# Altium schematic sheet GPSDO.SchDoc
size 594 x 420 mm; SheetNumber: 1; SheetTotal: 1
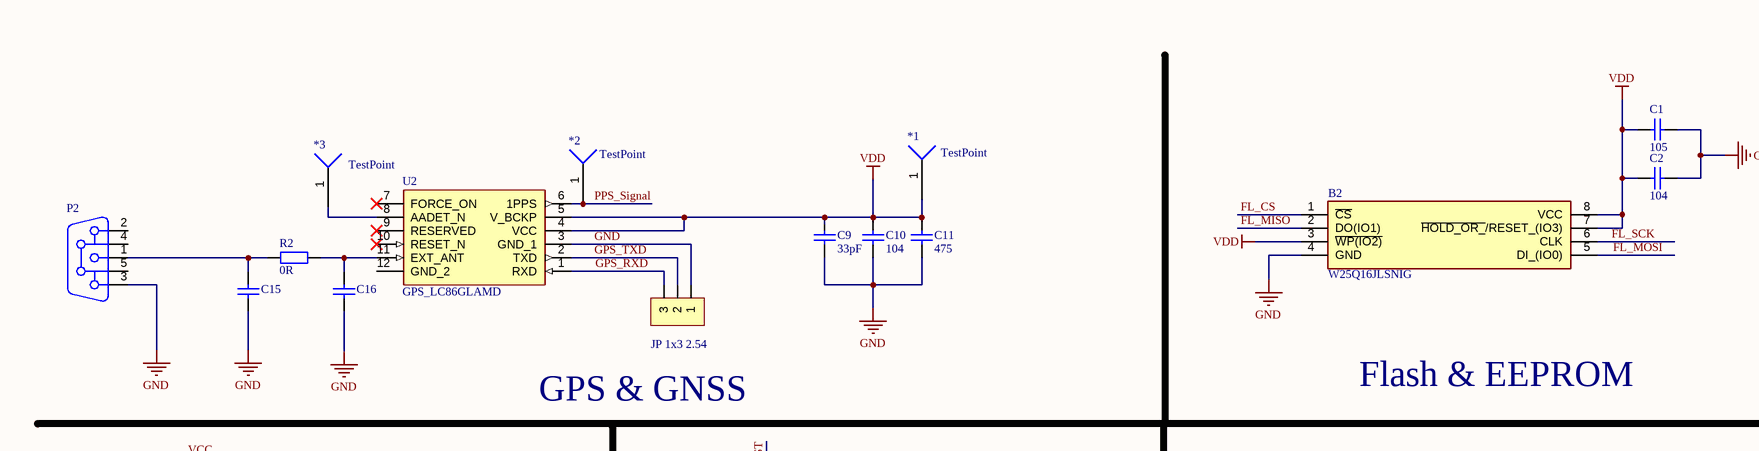
[diagram p0: GPSDO.SchDoc, top left]
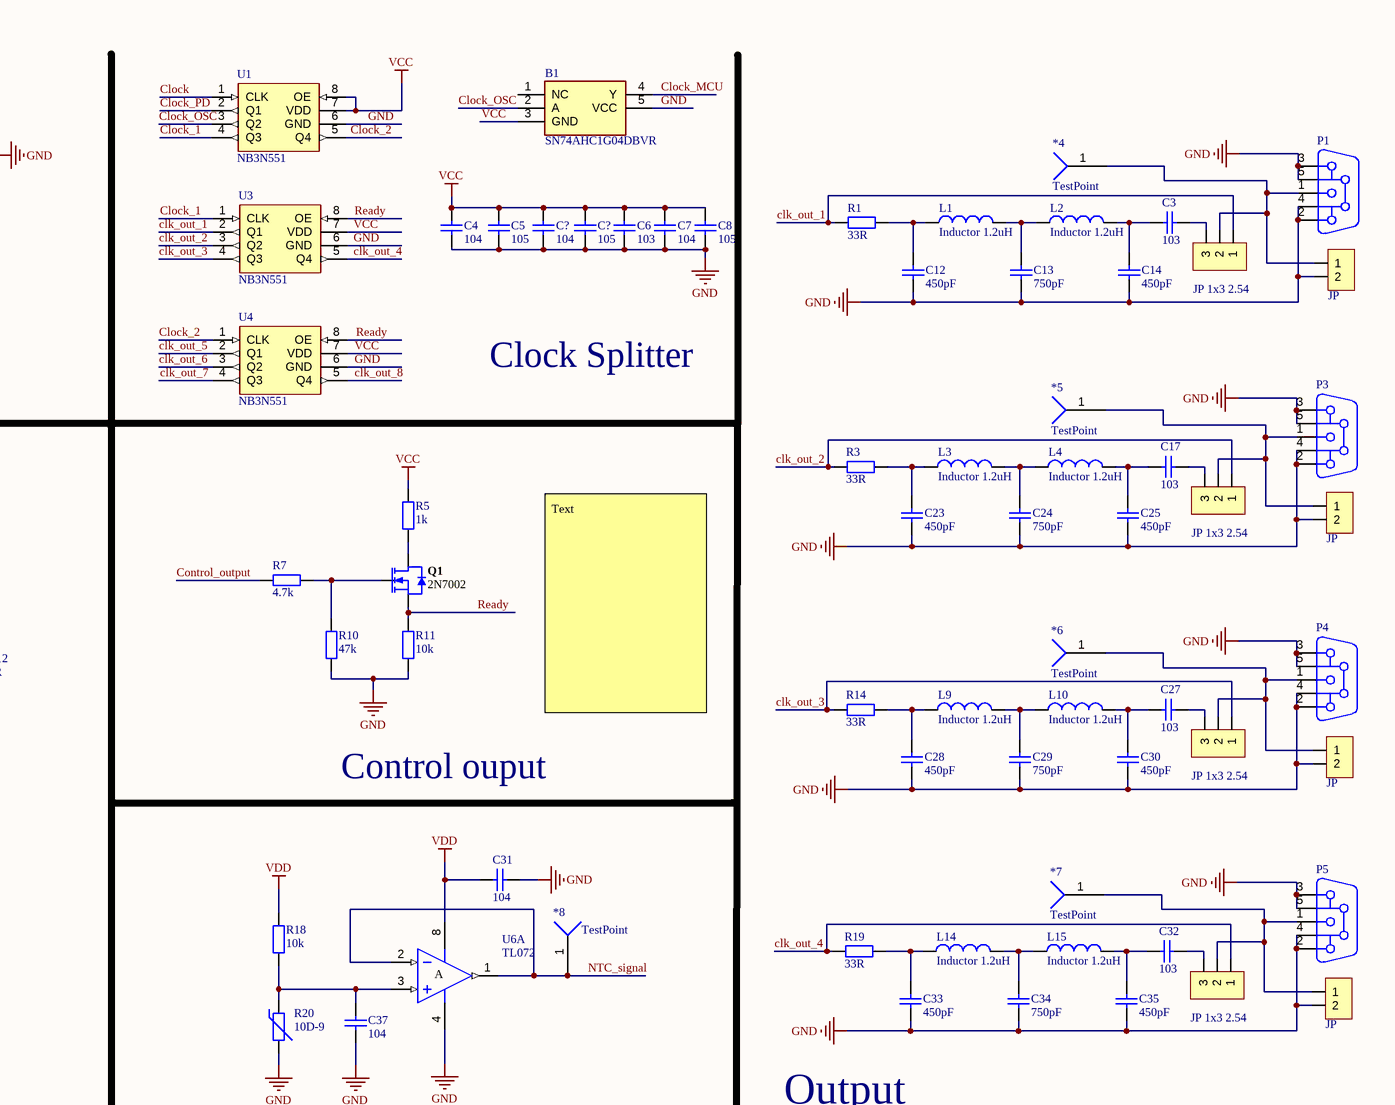
[diagram p1: GPSDO.SchDoc, top right]
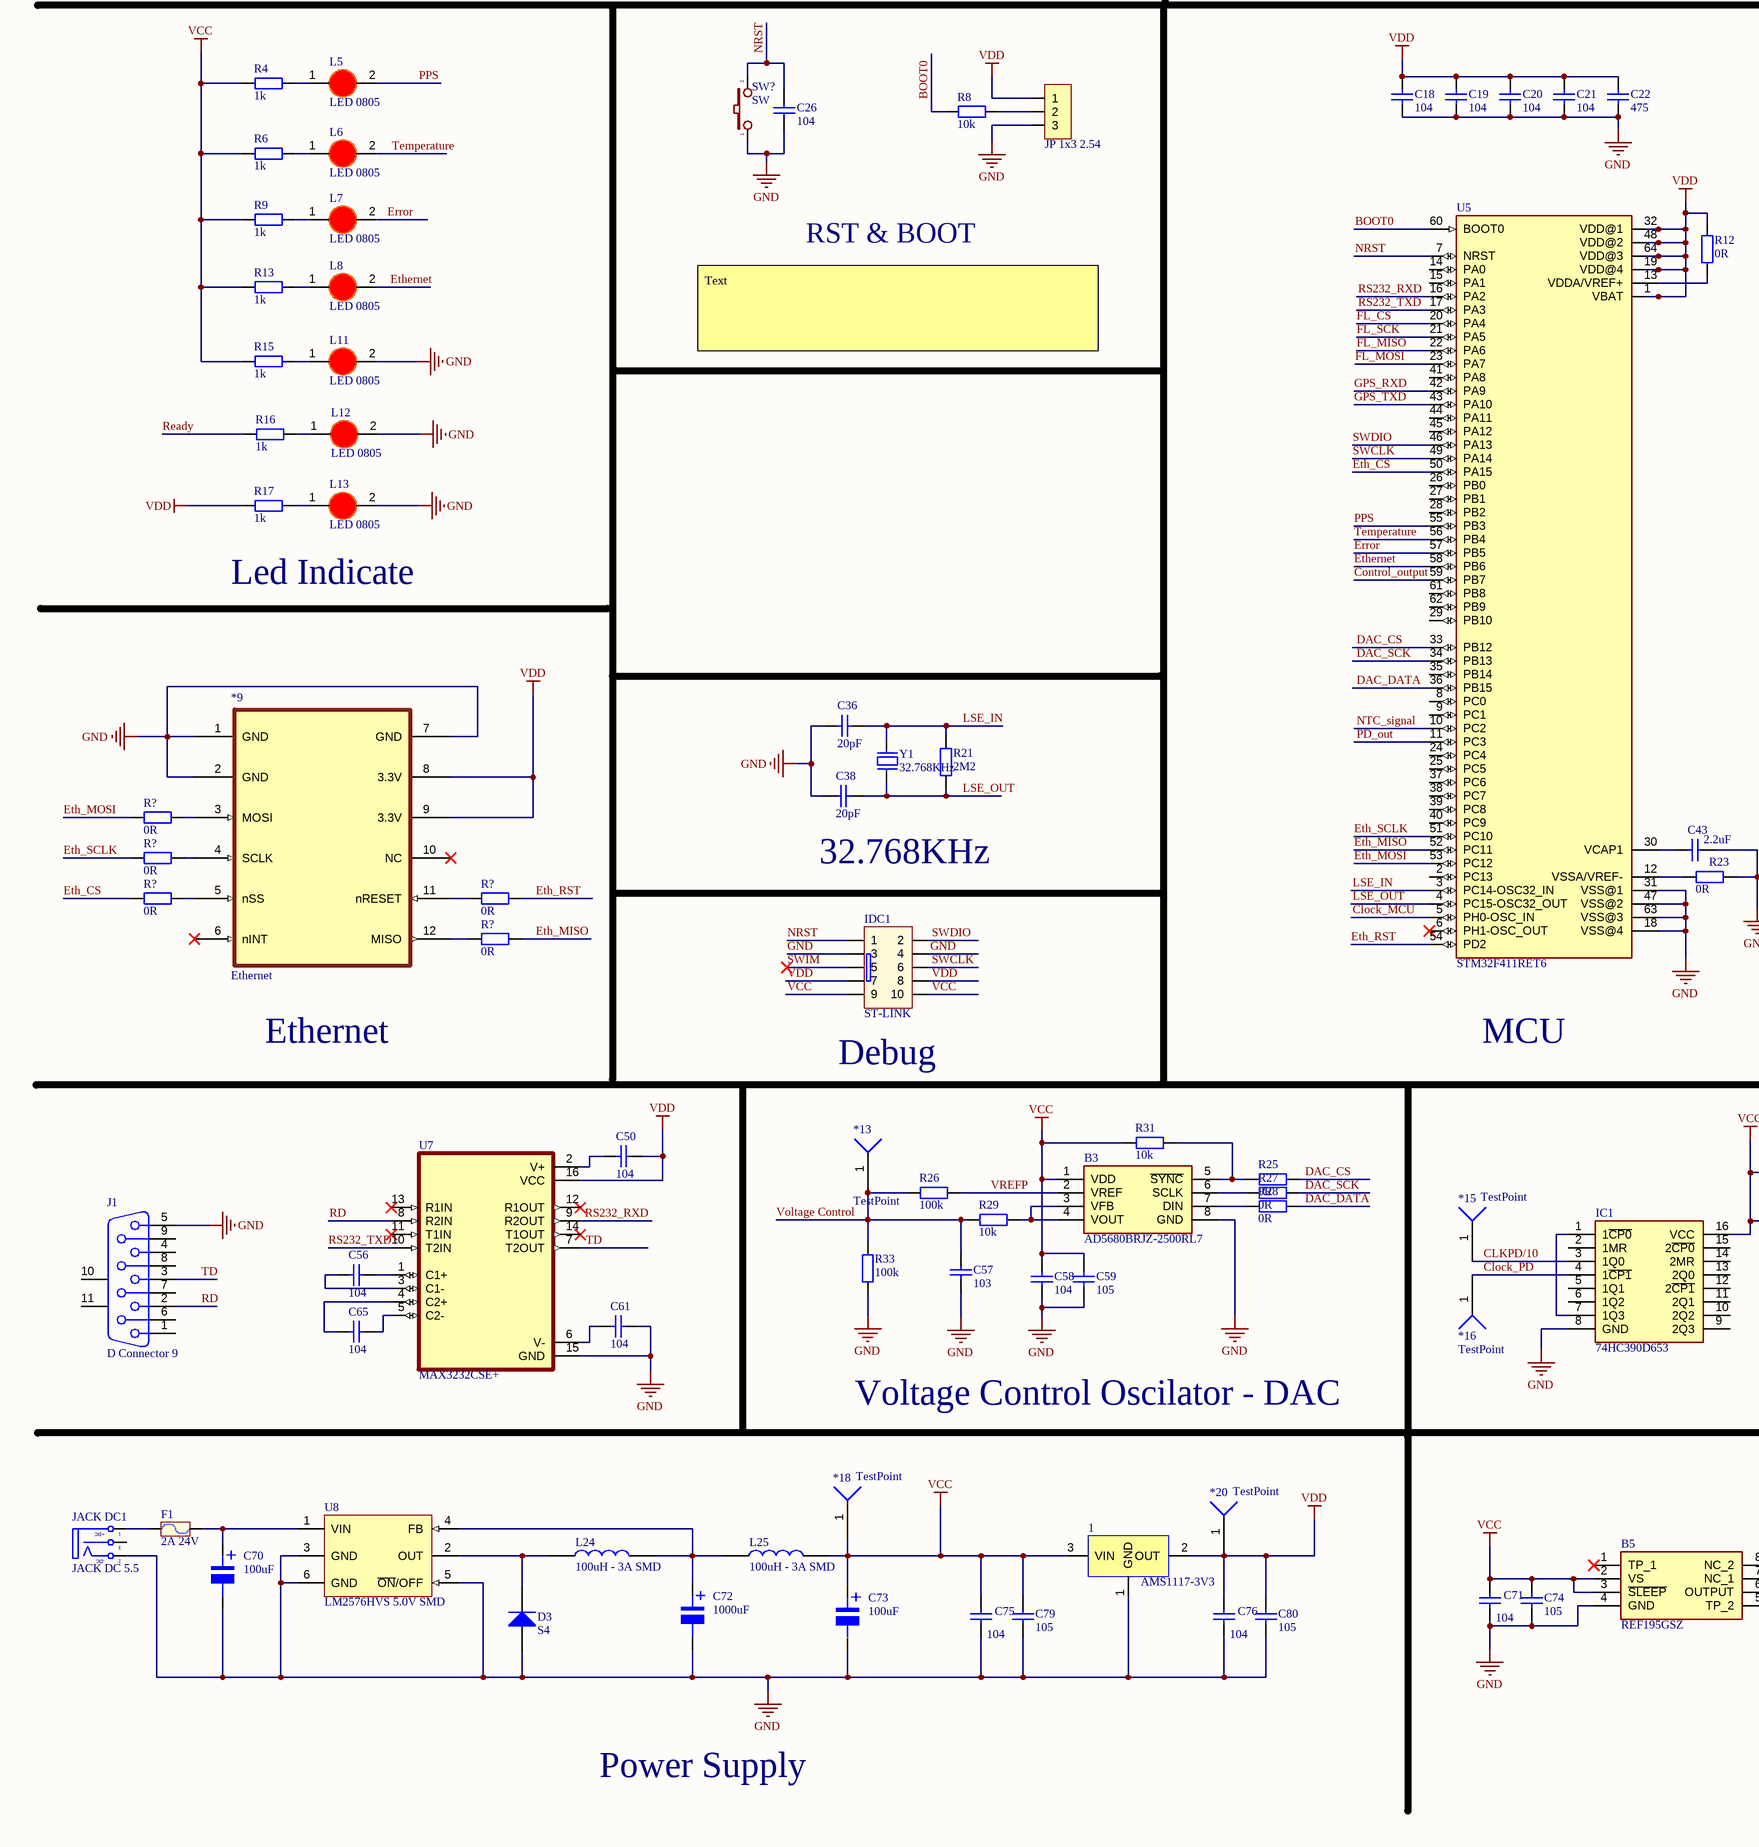
[diagram p2: GPSDO.SchDoc, bottom left]
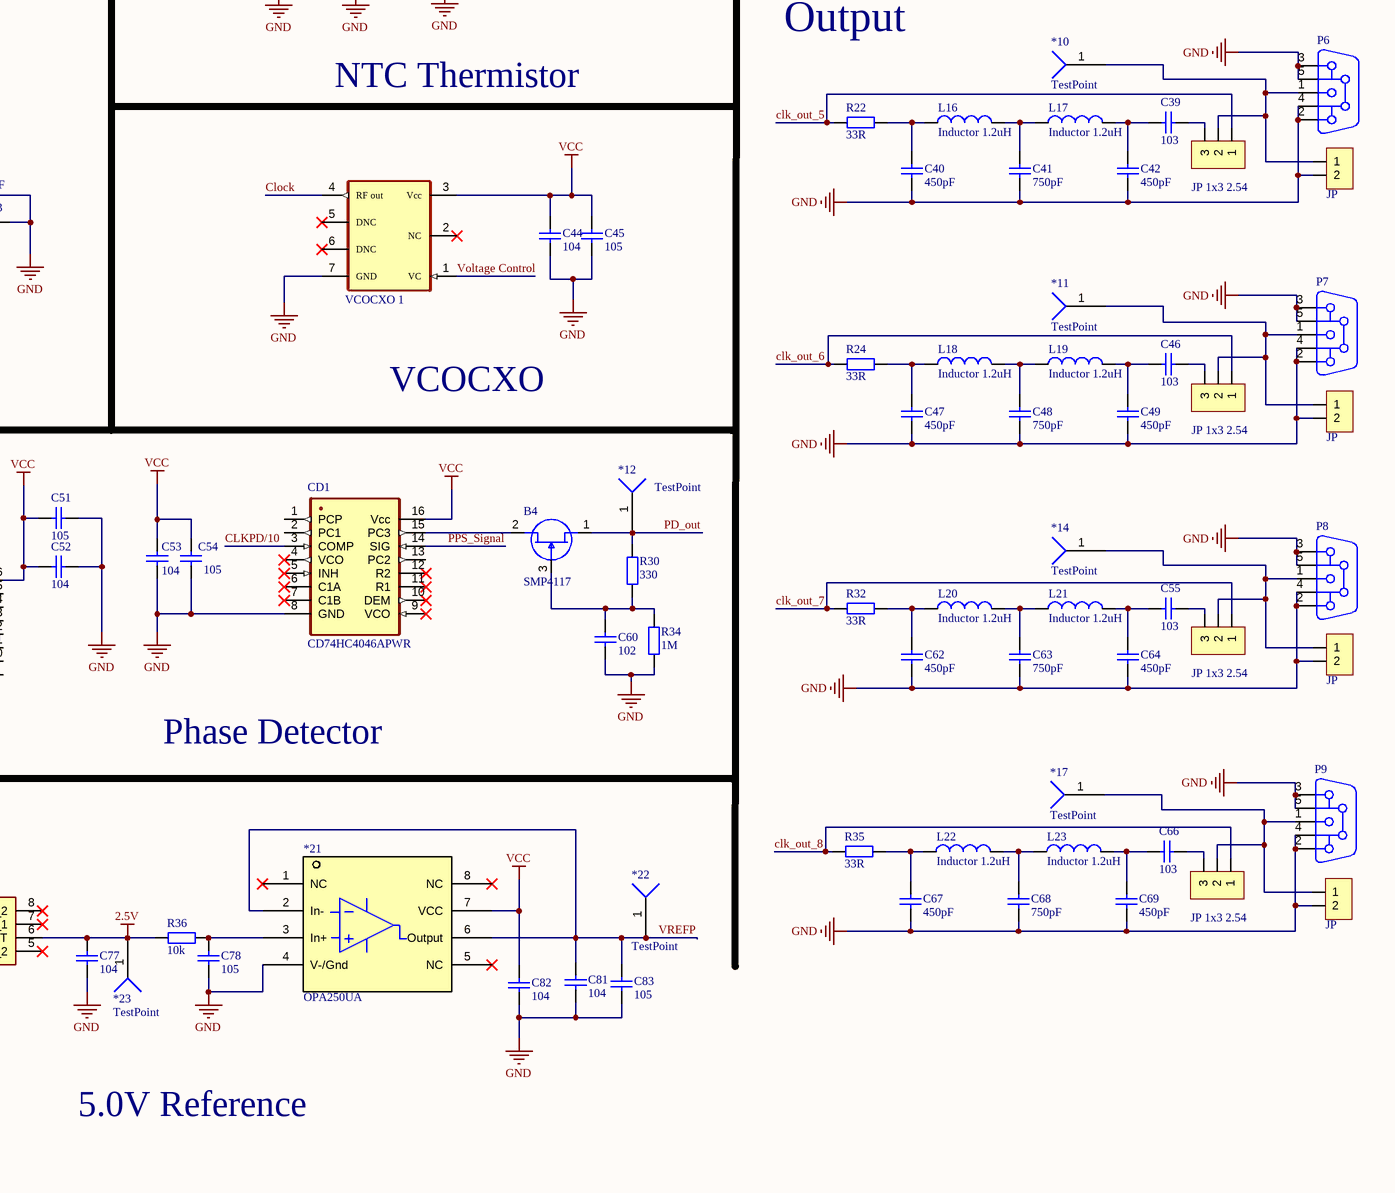
[diagram p3: GPSDO.SchDoc, bottom right]

## Parts
(Parts that share a designator on the sheet are numbered #1, #2 ... from top to bottom, then left to right.)
1  AMS1117-3V3  [SOT223]
*1  TestPoint  [TestPoint]
*2  TestPoint  [TestPoint]
*3  TestPoint  [TestPoint]
*4  TestPoint  [TestPoint]
*5  TestPoint  [TestPoint]
*6  TestPoint  [TestPoint]
*7  TestPoint  [TestPoint]
*8  TestPoint  [TestPoint]
*9  Ethernet  [PCBComponent_1]
*10  TestPoint  [TestPoint]
*11  TestPoint  [TestPoint]
*12  TestPoint  [TestPoint]
*13  TestPoint  [TestPoint]
*14  TestPoint  [TestPoint]
*15  TestPoint  [TestPoint]
*16  TestPoint  [TestPoint]
*17  TestPoint  [TestPoint]
*18  TestPoint  [TestPoint]
*20  TestPoint  [TestPoint]
*21  OPA250UA  [OPA350UA]
*22  TestPoint  [TestPoint]
*23  TestPoint  [TestPoint]
B1  SN74AHC1G04DBVR  [SOT95P280X145-5N]
B2  W25Q16JLSNIG  [SOIC127P600X175-8N]
B3  AD5680BRJZ-2500RL7  [SOT65P280X145-8N]
B4  SMP4117  [SOT95P237X112-3N]
B5  REF195GSZ  [SOIC127P600X175-8N]
C1  105  [tu 0805]
C2  104  [tu 0805]
C3  103  [tu 0805]
C4  104  [tu 0805]
C5  105  [tu 0805]
C6  103  [tu 0805]
C7  104  [tu 0805]
C8  105  [tu 0805]
C9  33pF  [tu 0805]
C10  104  [tu 0805]
C11  475  [tu 0805]
C12  450pF  [tu 0805]
C13  750pF  [tu 0805]
C14  450pF  [tu 0805]
C15  (no value)  [tu 0805]
C16  (no value)  [tu 0805]
C17  103  [tu 0805]
C18  104  [tu 0805]
C19  104  [tu 0805]
C20  104  [tu 0805]
C21  104  [tu 0805]
C22  475  [tu 0805]
C23  450pF  [tu 0805]
C24  750pF  [tu 0805]
C25  450pF  [tu 0805]
C26  104  [tu 0805]
C27  103  [tu 0805]
C28  450pF  [tu 0805]
C29  750pF  [tu 0805]
C30  450pF  [tu 0805]
C31  104  [tu 0805]
C32  103  [tu 0805]
C33  450pF  [tu 0805]
C34  750pF  [tu 0805]
C35  450pF  [tu 0805]
C36  20pF  [tu 0805]
C37  104  [tu 0805]
C38  20pF  [tu 0805]
C39  103  [tu 0805]
C40  450pF  [tu 0805]
C41  750pF  [tu 0805]
C42  450pF  [tu 0805]
C43  2.2uF  [tu 0805]
C44  104  [tu 0805]
C45  105  [tu 0805]
C46  103  [tu 0805]
C47  450pF  [tu 0805]
C48  750pF  [tu 0805]
C49  450pF  [tu 0805]
C50  104  [tu 0805]
C51  105  [tu 0805]
C52  104  [tu 0805]
C53  104  [tu 0805]
C54  105  [tu 0805]
C55  103  [tu 0805]
C56  104  [tu 0805]
C57  103  [tu 0805]
C58  104  [tu 0805]
C59  105  [tu 0805]
C60  102  [tu 0805]
C61  104  [tu 0805]
C62  450pF  [tu 0805]
C63  750pF  [tu 0805]
C64  450pF  [tu 0805]
C65  104  [tu 0805]
C66  103  [tu 0805]
C67  450pF  [tu 0805]
C68  750pF  [tu 0805]
C69  450pF  [tu 0805]
C70  100uF  [tu nhom 6.3 (d)]
C71  104  [tu 0805]
C72  1000uF  [tu nhom 10 (G)]
C73  100uF  [tu nhom 6.3 (d)]
C74  105  [tu 0805]
C75  104  [tu 0805]
C76  104  [tu 0805]
C77  104  [tu 0805]
C78  105  [tu 0805]
C79  105  [tu 0805]
C80  105  [tu 0805]
C81  104  [tu 0805]
C82  104  [tu 0805]
C83  105  [tu 0805]
C?#1  104  [tu 0805]
C?#2  105  [tu 0805]
CD1  CD74HC4046APWR  [TSSOP16]
D3  S4  [DIODE SOD-123]
F1  2A 24V  [Cau chi tu phuc hoi 2A 24V SMD1812]
IC1  74HC390D653  [74HC390D653]
IDC1  ST-LINK  [IDC10]
J1  D Connector 9  [DSUB1.385-2H9]
JACK_DC1  JACK DC 5.5  [JACK DC 5.5]
JP1  JP  [JP 1x2 DT]
JP2  JP 1x3 2.54  [JP 1x3 CT]
JP3  JP 1x3 2.54  [JP 1x3 DT]
JP4  JP  [JP 1x2 DT]
JP5  JP 1x3 2.54  [JP 1x3 CT]
JP6  JP 1x3 2.54  [JP 1x3 DT]
JP7  JP  [JP 1x2 DT]
JP8  JP 1x3 2.54  [JP 1x3 CT]
JP9  JP  [JP 1x2 DT]
JP10  JP 1x3 2.54  [JP 1x3 CT]
JP11  JP  [JP 1x2 DT]
JP12  JP 1x3 2.54  [JP 1x3 CT]
JP13  JP  [JP 1x2 DT]
JP14  JP 1x3 2.54  [JP 1x3 CT]
JP15  JP  [JP 1x2 DT]
JP16  JP 1x3 2.54  [JP 1x3 CT]
JP17  JP  [JP 1x2 DT]
JP18  JP 1x3 2.54  [JP 1x3 CT]
L1  Inductor 1.2uH  [INDC2012X100N]
L2  Inductor 1.2uH  [INDC2012X100N]
L3  Inductor 1.2uH  [INDC2012X100N]
L4  Inductor 1.2uH  [INDC2012X100N]
L5  LED 0805  [LED-0805-Red]
L6  LED 0805  [LED-0805-Red]
L7  LED 0805  [LED-0805-Red]
L8  LED 0805  [LED-0805-Red]
L9  Inductor 1.2uH  [INDC2012X100N]
L10  Inductor 1.2uH  [INDC2012X100N]
L11  LED 0805  [LED-0805-Red]
L12  LED 0805  [LED-0805-Red]
L13  LED 0805  [LED-0805-Red]
L14  Inductor 1.2uH  [INDC2012X100N]
L15  Inductor 1.2uH  [INDC2012X100N]
L16  Inductor 1.2uH  [INDC2012X100N]
L17  Inductor 1.2uH  [INDC2012X100N]
L18  Inductor 1.2uH  [INDC2012X100N]
L19  Inductor 1.2uH  [INDC2012X100N]
L20  Inductor 1.2uH  [INDC2012X100N]
L21  Inductor 1.2uH  [INDC2012X100N]
L22  Inductor 1.2uH  [INDC2012X100N]
L23  Inductor 1.2uH  [INDC2012X100N]
L24  100uH - 3A SMD  [Cuon Cam 12x12x10]
L25  100uH - 3A SMD  [Cuon Cam 12x12x10]
P1  (no value)  [SMA-V]
P2  (no value)  [SMA-V]
P3  (no value)  [SMA-V]
P4  (no value)  [SMA-V]
P5  (no value)  [SMA-V]
P6  (no value)  [SMA-V]
P7  (no value)  [SMA-V]
P8  (no value)  [SMA-V]
P9  (no value)  [SMA-V]
Q1  2N7002  [SOT23-123]
R1  33R  [tro smd 0805]
R2  0R  [tro smd 0805]
R3  33R  [tro smd 0805]
R4  1k  [tro smd 0805]
R5  1k  [tro smd 0805]
R6  1k  [tro smd 0805]
R7  4.7k  [tro smd 0805]
R8  10k  [tro smd 0805]
R9  1k  [tro smd 0805]
R10  47k  [tro smd 0805]
R11  10k  [tro smd 0805]
R12  0R  [tro smd 0805]
R13  1k  [tro smd 0805]
R14  33R  [tro smd 0805]
R15  1k  [tro smd 0805]
R16  1k  [tro smd 0805]
R17  1k  [tro smd 0805]
R18  10k  [tro smd 0805]
R19  33R  [tro smd 0805]
R20  10D-9  [tro nhiet d-9]
R21  2M2  [tro smd 0805]
R22  33R  [tro smd 0805]
R23  0R  [tro smd 0805]
R24  33R  [tro smd 0805]
R25  0R  [tro smd 0805]
R26  100k  [tro smd 0805]
R27  0R  [tro smd 0805]
R28  0R  [tro smd 0805]
R29  10k  [tro smd 0805]
R30  330  [tro smd 0805]
R31  10k  [tro smd 0805]
R32  33R  [tro smd 0805]
R33  100k  [tro smd 0805]
R34  1M  [tro smd 0805]
R35  33R  [tro smd 0805]
R36  10k  [tro smd 0805]
R?#1  0R  [tro smd 0805]
R?#2  0R  [tro smd 0805]
R?#3  0R  [tro smd 0805]
R?#4  0R  [tro smd 0805]
R?#5  0R  [tro smd 0805]
SW?  SW  [SW1-DIP]
U1  NB3N551  [SOIC8]
U2  GPS_LC86GLAMD  [LC86LICMD]
U3  NB3N551  [SOIC8]
U4  NB3N551  [SOIC8]
U5  STM32F411RET6  [QFP50P1200X1200X160-64N]
U6  TL072  [SO8]  (part A of 2)
U7  MAX3232CSE+  [SOIC127P600X175-16N]
U8  LM2576HVS 5.0V SMD  [TO263-5]
VCOCXO_1  OCXO  [PCBComponent_1]  (value not drawn)
Y1  32.768KHz  [Thach Anh 2 chan cam]

## Nets
2.5V: *23.1 B5.6(OUTPUT) C77.1 R36.1
GND: 1.1(GND) *9.1(GND) *9.2(GND) *9.7(GND) *21.4(V-/Gnd) B1.5(VCC) B2.4(GND) B3.8(GND) B5.4(GND) C1.2 C2.2 C4.2 C5.2 C6.1 C7.2 C8.2 C9.2 C10.2 C11.2 C12.2 C13.2 C14.2 C15.2 C16.2 C18.2 C19.2 C20.2 C21.2 C22.2 C23.2 C24.2 C25.2 C26.2 C28.2 C29.2 C30.2 C31.2 C33.2 C34.2 C35.2 C36.1 C37.2 C38.1 C40.2 C41.2 C42.2 C43.2 C44.2 C45.2 C47.2 C48.2 C49.2 C51.2 C52.2 C53.2 C54.2 C57.2 C58.2 C59.2 C60.2 C61.2 C62.2 C63.2 C64.2 C67.2 C68.2 C69.2 C70.2 C71.2 C72.2 C73.2 C74.2 C75.2 C76.2 C77.2 C78.2 C79.2 C80.2 C81.2 C82.2 C83.2 C?#1.2 C?#2.2 CD1.8(GND) D3.1(A) IC1.8(GND) IDC1.3 IDC1.4 J1.5 JACK_DC1.2(TN) JP1.2 JP3.1 JP4.2 JP6.3 JP7.2 JP9.2 JP11.2 JP13.2 JP15.2 JP17.2 L11.2(K) L12.2(K) L13.2(K) P1.2 P1.3 P1.4 P1.5 P2.3 P3.2 P3.3 P3.4 P3.5 P4.2 P4.3 P4.4 P4.5 P5.2 P5.3 P5.4 P5.5 P6.2 P6.3 P6.4 P6.5 P7.2 P7.3 P7.4 P7.5 P8.2 P8.3 P8.4 P8.5 P9.2 P9.3 P9.4 P9.5 R10.2 R11.2 R20.2 R23.1 R33.2 R34.2 SW?.1 U1.6(GND) U2.3(GND_1) U3.6(GND) U4.6(GND) U5.18(VSS@4) U5.31(VSS@1) U5.47(VSS@2) U5.63(VSS@3) U6.4(V-) U7.15(GND) U8.3(GND) U8.5(~{ON}/OFF) U8.6(GND) VCOCXO_1.7(GND)
VCC: 1.3(VIN) *18.1 *21.7(VCC) B1.3(GND) B3.1(VDD) B5.2(VS) B5.3(~{SLEEP}) C4.1 C5.1 C6.2 C7.1 C8.1 C44.1 C45.1 C51.1 C52.1 C53.1 C54.1 C58.1 C59.1 C71.1 C73.1 C74.1 C75.1 C79.1 C82.1 C?#1.1 C?#2.1 CD1.16(Vcc) IC1.16(VCC) IDC1.9 IDC1.10 L25.2 R4.1 R5.1 R6.1 R9.1 R13.1 R15.1 R31.2 U1.7(VDD) U1.8(OE) U3.7(VDD) U4.7(VDD) VCOCXO_1.3(Vcc)
VDD: 1.2(OUT) *1.1 *9.8(3.3V) *9.9(3.3V) *20.1 B2.3(~{WP(IO2)}) B2.7(~{HOLD_OR_}/RESET_(IO3)) B2.8(VCC) C1.1 C2.1 C9.1 C10.1 C11.1 C18.1 C19.1 C20.1 C21.1 C22.1 C31.1 C50.1 C76.1 C80.1 IDC1.7 IDC1.8 JP6.1 R12.1 R17.1 R18.1 U2.4(VCC) U2.5(V_BCKP) U5.1(VBAT) U5.19(VDD@4) U5.32(VDD@1) U5.48(VDD@2) U5.64(VDD@3) U6.8(V+) U7.16(VCC)
BOOT0: R8.2 U5.60(BOOT0)
clk_out_1: JP2.1 R1.2 U3.2(Q1)
clk_out_2: JP5.1 R3.2 U3.3(Q2)
clk_out_3: JP8.1 R14.2 U3.4(Q3)
clk_out_4: JP10.1 R19.2 U3.5(Q4)
clk_out_5: JP12.1 R22.2 U4.2(Q1)
clk_out_6: JP14.1 R24.2 U4.3(Q2)
clk_out_7: JP16.1 R32.2 U4.4(Q3)
clk_out_8: JP18.1 R35.2 U4.5(Q4)
CLKPD/10: *15.1 CD1.3(COMP) IC1.3(1Q0)
Clock: U1.1(CLK) VCOCXO_1.4(RF_out)
Clock_1: U1.4(Q3) U3.1(CLK)
Clock_2: U1.5(Q4) U4.1(CLK)
Clock_MCU: B1.4(Y) U5.5(PH0-OSC_IN)
Clock_OSC: B1.2(A) U1.3(Q2)
Clock_PD: *16.1 IC1.4(1~{CP1}) U1.2(Q1)
Control_output: R7.2 U5.59(PB7)
DAC_CS: R25.1 U5.33(PB12)
DAC_DATA: R28.1 U5.36(PB15)
DAC_SCK: R27.1 U5.34(PB13)
Error: L7.2(K) U5.57(PB5)
Eth_CS: R?#3.2 U5.50(PA15)
Eth_MISO: R?#5.1 U5.52(PC11)
Eth_MOSI: R?#1.2 U5.53(PC12)
Eth_RST: R?#4.1 U5.54(PD2)
Eth_SCLK: R?#2.2 U5.51(PC10)
Ethernet: L8.2(K) U5.58(PB6)
FL_CS: B2.1(~{CS}) U5.20(PA4)
FL_MISO: B2.2(DO(IO1)) U5.22(PA6)
FL_MOSI: B2.5(DI_(IO0)) U5.23(PA7)
FL_SCK: B2.6(CLK) U5.21(PA5)
GPS_RXD: JP3.3 U2.1(RXD) U5.42(PA9)
GPS_TXD: JP3.2 U2.2(TXD) U5.43(PA10)
LSE_IN: C36.2 R21.1 U5.3(PC14-OSC32_IN) Y1.2
LSE_OUT: C38.2 R21.2 U5.4(PC15-OSC32_OUT) Y1.1
NRST: C26.1 IDC1.1 SW?.2 U5.7(NRST)
NTC_signal: *8.1 U5.10(PC2) U6.1(OUT) U6.2(IN-)
PD_out: *12.1 B4.1(S) R30.1 U5.11(PC3)
PPS: L5.2(K) U5.55(PB3)
PPS_Signal: *2.1 CD1.14(SIG) U2.6(1PPS)
RD: J1.2 U7.8(R2IN)
Ready: Q1.3(S) R11.1 R16.1 U3.8(OE) U4.8(OE)
RS232_RXD: U5.16(PA2) U7.9(R2OUT)
RS232_TXD: U5.17(PA3) U7.10(T2IN)
SWCLK: IDC1.6 U5.49(PA14)
SWDIO: IDC1.2 U5.46(PA13)
SWIM: IDC1.5
TD: J1.3 U7.7(T2OUT)
Temperature: L6.2(K) U5.56(PB4)
Voltage Control: *13.1 C57.1 R26.1 R29.2 R33.1 VCOCXO_1.1(VC)
VREFP: *21.2(In-) *21.6(Output) *22.1 B3.2(VREF) C81.1 C83.1 R26.2
Net*3_1: *3.1 U2.8(AADET_N)
Net*4_1: *4.1 JP1.1 JP2.2 P1.1
Net*5_1: *5.1 JP4.1 JP5.2 P3.1
Net*6_1: *6.1 JP7.1 JP8.2 P4.1
Net*7_1: *7.1 JP9.1 JP10.2 P5.1
Net*9_3: *9.3(MOSI) R?#1.1
Net*9_4: *9.4(SCLK) R?#2.1
Net*9_5: *9.5(nSS) R?#3.1
Net*9_11: *9.11(nRESET) R?#4.2
Net*9_12: *9.12(MISO) R?#5.2
Net*10_1: *10.1 JP11.1 JP12.2 P6.1
Net*11_1: *11.1 JP13.1 JP14.2 P7.1
Net*14_1: *14.1 JP15.1 JP16.2 P8.1
Net*17_1: *17.1 JP17.1 JP18.2 P9.1
Net*21_3: *21.3(In+) C78.1 R36.2
NetB3_3: B3.3(VFB) B3.4(VOUT) R29.1
NetB3_5: B3.5(~{SYNC}) R25.2 R31.1
NetB3_6: B3.6(SCLK) R27.2
NetB3_7: B3.7(DIN) R28.2
NetB4_2: B4.2(D) CD1.15(PC3)
NetB4_3: B4.3(G) C60.1 R30.2 R34.1
NetC3_1: C3.1 C14.1 L2.2
NetC3_2: C3.2 JP2.3
NetC12_1: C12.1 L1.1 R1.1
NetC13_1: C13.1 L1.2 L2.1
NetC15_1: C15.1 P2.1 R2.1
NetC16_1: C16.1 R2.2 U2.11(EXT_ANT)
NetC17_1: C17.1 C25.1 L4.2
NetC17_2: C17.2 JP5.3
NetC23_1: C23.1 L3.1 R3.1
NetC24_1: C24.1 L3.2 L4.1
NetC27_1: C27.1 C30.1 L10.2
NetC27_2: C27.2 JP8.3
NetC28_1: C28.1 L9.1 R14.1
NetC29_1: C29.1 L9.2 L10.1
NetC32_1: C32.1 C35.1 L15.2
NetC32_2: C32.2 JP10.3
NetC33_1: C33.1 L14.1 R19.1
NetC34_1: C34.1 L14.2 L15.1
NetC37_1: C37.1 R18.2 R20.1 U6.3(IN+)
NetC39_1: C39.1 C42.1 L17.2
NetC39_2: C39.2 JP12.3
NetC40_1: C40.1 L16.1 R22.1
NetC41_1: C41.1 L16.2 L17.1
NetC43_1: C43.1 U5.30(VCAP1)
NetC46_1: C46.1 C49.1 L19.2
NetC46_2: C46.2 JP14.3
NetC47_1: C47.1 L18.1 R24.1
NetC48_1: C48.1 L18.2 L19.1
NetC50_2: C50.2 U7.2(V+)
NetC55_1: C55.1 C64.1 L21.2
NetC55_2: C55.2 JP16.3
NetC56_1: C56.1 U7.3(C1-)
NetC56_2: C56.2 U7.1(C1+)
NetC61_1: C61.1 U7.6(V-)
NetC62_1: C62.1 L20.1 R32.1
NetC63_1: C63.1 L20.2 L21.1
NetC65_1: C65.1 U7.4(C2+)
NetC65_2: C65.2 U7.5(C2-)
NetC66_1: C66.1 C69.1 L23.2
NetC66_2: C66.2 JP18.3
NetC67_1: C67.1 L22.1 R35.1
NetC68_1: C68.1 L22.2 L23.1
NetC70_1: C70.1 F1.2 U8.1(VIN)
NetC72_1: C72.1 L24.2 L25.1 U8.4(FB)
NetD3_2: D3.2(K) L24.1 U8.2(OUT)
NetF1_1: F1.1 JACK_DC1.1(T)
NetIC1_1: IC1.1(1~{CP0}) IC1.7(1Q3)
NetJP6_2: JP6.2 R8.1
NetL5_1: L5.1(A) R4.2
NetL6_1: L6.1(A) R6.2
NetL7_1: L7.1(A) R9.2
NetL8_1: L8.1(A) R13.2
NetL11_1: L11.1(A) R15.2
NetL12_1: L12.1(A) R16.2
NetL13_1: L13.1(A) R17.2
NetQ1_1: Q1.1(G) R7.1 R10.1
NetQ1_2: Q1.2(D) R5.2
NetR12_2: R12.2 U5.13(VDDA/VREF+)
NetR23_2: R23.2 U5.12(VSSA/VREF-)

Not connected (* = marked no-connect by the designer): *9 6(nINT)* 10(NC)*; *21 1(NC)* 5(NC)* 8(NC)*; B1 1(NC); B5 1(TP_1)* 5(TP_2)* 7(NC_1)* 8(NC_2)*; CD1 1(PCP) 2(PC1) 4(VCO)* 5(INH)* 6(C1A)* 7(C1B)* 9(VCO)* 10(DEM)* 11(R1)* 12(R2)* 13(PC2); IC1 2(1MR) 5(1Q1) 6(1Q2) 9(2Q3) 10(2Q2) 11(2Q1) 12(2~{CP1}) 13(2Q0) 14(2MR) 15(2~{CP0}); J1 1 4 6 7 8 9 10(MH1) 11(MH2); JACK_DC1 3(S); P2 2 4 5; U2 7(FORCE_ON)* 9(RESERVED)* 10(RESET_N)* 12(GND_2); U5 2(PC13) 6(PH1-OSC_OUT)* 8(PC0) 9(PC1) 14(PA0) 15(PA1) 24(PC4) 25(PC5) 26(PB0) 27(PB1) 28(PB2) 29(PB10) 35(PB14) 37(PC6) 38(PC7) 39(PC8) 40(PC9) 41(PA8) 44(PA11) 45(PA12) 61(PB8) 62(PB9); U7 11(T1IN)* 12(R1OUT)* 13(R1IN)* 14(T1OUT)*; VCOCXO_1 2(NC)* 5(DNC)* 6(DNC)*

## Notes on the sheet
- Flash & EEPROM
- Clock Splitter
- GPS & GNSS
- RST & BOOT
- Text
- Control ouput
- Led Indicate
- Output
- NTC Thermistor
- 32.768KHz
- Ethernet
- MCU
- VCOCXO
- (near IDC1) Debug
- Voltage Control Oscilator - DAC
- Phase Detector
- Power Supply
- 5.0V Reference
- DWG NO:
- REV:
- THIS DOCUMENT AND THE DATA DISCLOSED HEREIN OR
- HEREWITH IS THE PROPERTY OF ALTIUM LIMITED AND MAY
- BE FREELY DISTRIBUTED IN WHOLE. NO RIGHTS ARE
- RESERVED OR EXPRESS OR IMPLIED WARANTEE GIVEN.
- REVISION
- DESCRIPTION
- DATE
- APPROVED
- ENG:
- APPROVALS
- PROJECT
- DSN:
- CHK:
- REFERENCE DOCUMENTS
- PROJECT REVISION:
- TITLE
- DOCUMENT REVISION:
- DESIGN ITEM:
- BOM:
- FAB DWG:
- PCB DWG:
- ASSY DWG:
- SCALE:
- A2
- SIZE
- CAGE CODE
- FILE NAME
- DWG NO.
- SHEET
- OF
- REV
- (in symbol CD74HC4046APWR) •
- (in symbol JACK DC 5.5) +DC; -DC
- (in symbol TL072, part A) A
- (in symbol Tu Nhom 100uF 16V) +
- (in symbol Tu Nhom 1000uF 16V) +

## Library data of the parts
1 = AMS1117-3V3: 800mA Low-Dropout Linear Regulator
B1 = SN74AHC1G04DBVR: SN74AHC1G04 Single Schmitt-Trigger Inverter Gate; Manufacturer_Name: Texas Instruments; Geometry.Height: 1.45mm; Mouser Part Number: 595-SN74AHC1G04DBVR; Mouser Price/Stock: https://www.mouser.co.uk/ProductDetail/Texas-Instruments/SN74AHC1G04DBVR?qs=UGVLDq%2F29ugShjfz5jg%2FkQ%3D%3D; Manufacturer_Part_Number: SN74AHC1G04DBVR; Datasheet Link: https://datasheet.datasheetarchive.com/originals/distributors/SFDatasheet-6/sf-000129664.pdf
B2 = W25Q16JLSNIG: Family of SpiFlash Memories  W25Q16JL: 16M-bit / 2M-byte (2,097,152)  256-byte per programmable page  Standard SPI: CLK, /CS, DI, DO, /WP, /Hold  Dual SPI: CLK, /CS, IO0, IO1, /WP, /Hold  Quad SPI: CLK, /CS, IO0, IO1, IO2, IO3  Highest Performance Serial Flash  104MHz Dual SPI / Quad SPI clocks  208/416MHz equivalent Dual/Quad SPI  50MB/S continuous data transfer rate  Up to 4X that of ordinary Serial Flash  Min. 100K Program-Erase cycles per sector  More than 20-year data retention; Manufacturer_Name: Winbond; Geometry.Height: 1.75mm; Mouser Part Number: 454-W25Q16JLSNIG; Mouser Price/Stock: https://www.mouser.co.uk/ProductDetail/Winbond/W25Q16JLSNIG?qs=qSfuJ%252Bfl%2Fd6WBE%252BDtZTG%252Bw%3D%3D; Manufacturer_Part_Number: W25Q16JLSNIG; Datasheet Link: https://www.winbond.com/hq/search-resource-file.jsp?partNo=W25Q16JLSNIG&type=datasheet
B3 = AD5680BRJZ-2500RL7: Analog Devices AD5680BRJZ-2500RL7, 18 bit Serial DAC, 8-Pin SOT-23; Geometry.Height: 1.45mm; Mouser Part Number: 584-AD5680BRJZ2500R7; Mouser Price/Stock: https://www.mouser.co.uk/ProductDetail/Analog-Devices/AD5680BRJZ-2500RL7?qs=NmRFExCfTkFkKEhFu2ZPFg%3D%3D; Manufacturer_Name: Analog Devices; Manufacturer_Part_Number: AD5680BRJZ-2500RL7; Datasheet Link: http://www.analog.com/media/en/technical-documentation/data-sheets/AD5680.pdf
B4 = SMP4117: JFET N-Channel -40V Low Ciss; Manufacturer_Name: InterFET; Geometry.Height: 1.12mm; Mouser Part Number: 106-SMP4117; Mouser Price/Stock: https://www.mouser.com/Search/Refine.aspx?Keyword=106-SMP4117; Manufacturer_Part_Number: SMP4117; Datasheet Link: https://componentsearchengine.com/Datasheets/1/SMP4117.pdf
B5 = REF195GSZ: REF195GSZ, Voltage Reference 4.99 to 5.01V, 2mV 30mA 18V max. 8-Pin SOIC; Manufacturer_Name: Analog Devices; Geometry.Height: 1.75mm; Mouser Part Number: 584-REF195GSZ; Mouser Price/Stock: https://www.mouser.co.uk/ProductDetail/Analog-Devices/REF195GSZ?qs=WIvQP4zGanjuFjB11hB3SA%3D%3D; Manufacturer_Part_Number: REF195GSZ; Datasheet Link: http://www.analog.com/static/imported-files/data_sheets/REF19xSeries.pdf
C1 C3 C5 C6 C8 C12-C14 C17 C20 C23-C25 C27-C30 C32-C35 C39-C42 C45-C49 C51 C54 C55 C57 C59 C60 C62-C64 C66-C69 C74 C78-C80 C?#2 = Tu 0805 105 50V 10%: Dán; Don_Vi: Con; So_Chan: 2; Ten_Linh_Kien: Tụ 0805 105-1uF 10% 50V; Ma_Hang: MH004552; Chung_Loai: Dán; Kieu_Chan: *
C2 C4 C7 C10 C19 C26 C31 C36-C38 C44 C50 C52 C53 C56 C58 C61 C65 C71 C75 C76 C81 C82 C?#1 = Tu 0805 104 50V 10%: Dán; Don_Vi: Con; So_Chan: 2; Ten_Linh_Kien: Tụ 0805 104-100nF 10% 50V; Ma_Hang: MH004551; Chung_Loai: Dán; Kieu_Chan: *
C9 = Tu 0805 33pF 50V 10%: Dán; Don_Vi: Con; So_Chan: 2; Ten_Linh_Kien: Tụ 0805 33p 10% 50V; Ma_Hang: MH004563; Chung_Loai: Dán; Kieu_Chan: *
C11 C22 = Tu 0805 475 25V 20%: Dán; Don_Vi: Con; So_Chan: 2; Ten_Linh_Kien: Tụ 0805 475-4.7uF 20% 25V; Ma_Hang: MH004276; Chung_Loai: Dán; Kieu_Chan: *
C15 C16 C18 C43 = Tu 0805 101 50V 20%: Dán; Don_Vi: Con; So_Chan: 2; Ten_Linh_Kien: Tụ 0805 101-0.1nF 50V 20%; Ma_Hang: MH002806; Chung_Loai: Dán; Kieu_Chan: *
C21 C77 C83 = Tu 0805 106 16V 10%: Dán; Ten_Linh_Kien: Tụ 0805 106-10uF 10% 16V; So_Chan: 2; Don_Vi: Con; Ma_Hang: MH004553; Chung_Loai: Dán; Kieu_Chan: *
C70 C73 = Tu Nhom 100uF 16V: Dán; Don_Vi: Con; So_Chan: 2; Ten_Linh_Kien: Tụ Nhôm 100uF 16V 6.3x5.4MM; Ma_Hang: MH002219; Chung_Loai: Dán; Kieu_Chan: *
C72 = Tu Nhom 1000uF 16V: Dán; Don_Vi: Con; So_Chan: 2; Ten_Linh_Kien: Tụ Nhôm 1000uF 16V 10x10MM; Ma_Hang: MH004419; Chung_Loai: Dán; Kieu_Chan: *
D3 = Diode S4: Dán; Ten_Linh_Kien: Diode S4 SOD123 ( 1N5819 SOD123); Ma_Hang: MH005519; Don_Vi: Con; Ghi_Chu: *; Chung_Loai: Dán; Kieu_Chan: *
F1 = Cau chi tu phuc hoi 2A 24V SMD1812: 2A 24V SMD1812; Ma_Hang: MH010033; Ten: Cầu Chì Tự Phục Hồi 2A 24V SMD1812
IC1 = 74HC390D653: Integrated Circuit; Manufacturer_Name: Nexperia; Manufacturer_Part_Number: 74HC390D,653; Datasheet Link: https://assets.nexperia.com/documents/data-sheet/74HC_HCT390.pdf; Height: 1.75mm; Mouser Part Number: 771-74HC390D-T; Mouser Price/Stock: https://www.mouser.co.uk/ProductDetail/Nexperia/74HC390D653?qs=P62ublwmbi%2FqDylHMJy%252BNA%3D%3D; Arrow Part Number: 74HC390D,653; Arrow Price/Stock: https://www.arrow.com/en/products/74hc390d653/nexperia?region=nac
IDC1 = IDC 5X2: Value: Header 5x2
J1 = D Connector 9: Receptacle Assembly, 9 Position, Right Angle; PackageDocument: O; Positions: 9; Published: 15-Jun-2001; LatestRevisionDate: 17-Jul-2002; LatestRevisionNote: Re-released for DXP Platform.; DatasheetDocument: 1-Sep-1999; PackageReference: 788750; Publisher: Altium Limited; Orientation: Right Angle; Gender: Receptacle
JACK_DC1 = JACK DC 5.5: Value: Jac DC
JP1 JP4 JP7 JP9 JP11 JP13 JP15 JP17 = JP 1x2 2.54 Duc Thang: Cắm; Ten_Linh_Kien: Jump Đơn Đực 2.54MM 1x40P Thẳng 11MM; Don_Vi: Con; Ma_Hang: MH000903; Ghi_Chu: *; Kieu_Chan: *; Chung_Loai: Cắm
JP2 JP5 JP8 JP10 JP12 JP14 JP16 JP18 = JP 1x3 2.54 Cai Thang: Cắm; Ten_Linh_Kien: Jump Đơn Cái 2.54MM 1x20P Thẳng; Don_Vi: Con; Ma_Hang: MH004006; Ghi_Chu: *; Kieu_Chan: *; Chung_Loai: Cắm
JP3 JP6 = JP 1x3 2.54 Duc Thang: Cắm; Ten_Linh_Kien: Jump Đơn Đực 2.54MM 1x40P Thẳng 11MM; Don_Vi: Con; Ma_Hang: MH000903; Ghi_Chu: *; Kieu_Chan: *; Chung_Loai: Cắm
L1-L4 L9 L10 L14-L23 = Inductor 1.2uH: Inductor with Inductance: 2.2uH Tol. +/-20%, Package: 0805 _2012_; MP: DFE201210U-2R2M=P2; MF: Murata; Digi-Key_Purchase_URL: https://www.digikey.com/product-detail/en/murata-electronics/DFE201210U-2R2M=P2/490-16592-1-ND/7595516?utm_source=snapeda&utm_medium=aggregator&utm_campaign=symbol; SnapEDA_Link: https://www.snapeda.com/parts/DFE201210U-2R2M%3DP2/Murata%20Electronics%20North%20America/view-part/1523615/?ref=snap; Value: *; Package: 2012 Murata; Digi-Key_Part_Number: 490-16592-1-ND
L5-L8 L11-L13 = LED 0805 Do: Dán; Don_Vi: Con; Ma_Hang: MH000897; Ten_Linh_Kien: LED 0805 Màu Đỏ (Red); Ghi_Chu: *; Kieu_Chan: *; Chung_Loai: Dán
L24 L25 = CUON CAM 100uH SMD: Dán; Don_Vi: Con; Ma_Hang: MH003999; Ten_Linh_Kien: Cuộn Cảm 100uH 7x7x4MM CD74; Ma_Hang: *; Kieu_Chan: *; Chung_Loai: Dán
P1-P9 = CON Ant: CONNECTOR ANTEN; partNo: 210111003; Manufacturer: Würth Elektronik eiSos GmbH; ComponentLink1Description: Manufacturer; ComponentLink1URL: http://www.we-online.de; Created by: Christin Zierenner; Created Date: May 2012; ComponentLink2Description: Datasheet; ComponentLink2URL: http://katalog.we-online.de/kataloge/eisos/index.php?language=en&pf=Filter_gerade
Q1 = 2N7002: N-channel Enhancement Mode Field-effect Transistor; Transistor Type: NPN; Mounting Technology: Surface Mount; Status: Unreleased; Category: Transistor-FET
R1 R3 R5 R7 R8 R10-R12 R14 R18 R19 R21-R36 R?#1-R?#5 = Tro 0805 1% 10k: Dán; Don_Vi: Con; So_Chan: 2; Ten_Linh_Kien: Trở 0805 1% 10k; Ma_Hang: MH005473; Chung_Loai: Dán; Kieu_Chan: *
R2 = Tro 0805 5% 0R: Dán; Don_Vi: Con; So_Chan: 2; Ten_Linh_Kien: Trở 0805 5% 0R; Ma_Hang: MH005230; Chung_Loai: Dán; Kieu_Chan: *
R4 R6 R9 R13 R15-R17 = Tro 0805 5% 1k: Dán; Don_Vi: Con; So_Chan: 2; Ten_Linh_Kien: Trở 0805 5% 1k; Ma_Hang: MH005234; Chung_Loai: Dán; Kieu_Chan: *
R20 = Tro Nhiet NTC 10D-9: Cắm; So_Chan: 2; Don_Vi: Con; Ten_Linh_Kien: Điện trở nhiệt NTC 10D-9; Ma_Hang: MH000922; Chung_Loai: Cắm; Kieu_Chan: *
SW? = SW2: Switch button 2 pin; Value: SW chip 2 pin
U2 = GPS_LC86LICMD
U5 = STM32F411RET6: ARM Cortex-M4 STM32F4 Microcontroller IC 32-Bit 100MHz 512KB _512K x 8_ FLASH 64-LQFP _10x10_; MF: STMicroelectronics; Package: LQFP-64 STMicroelectronics; Availability: Unavailable; Value: *; MP: STM32F411RET6; SnapEDA_Link: https://www.snapeda.com/parts/STM32F411RET6/STMicroelectronics/view-part/230206/?ref=snap; Price: None
U7 = MAX3232CSE+: 3.0V to 5.5V, Low-Power, Up to 1Mbps, True RS-232 Transceivers; MF: Analog Devices; Value: *; MP: MAX3232CSE+; Price: None; Package: SOIC-16 Maxim Integrated; Availability: In Stock; SnapEDA_Link: https://www.snapeda.com/parts/MAX3232CSE+/Analog+Devices/view-part/?ref=snap; Purchase-URL: https://pricing.snapeda.com/search/part/MAX3232CSE+/?ref=eda; Check_prices: https://www.snapeda.com/parts/MAX3232CSE+/Analog+Devices/view-part/?ref=eda
U8 = LM2576HVS 5.0V SMD: Dán; Ten_Linh_Kien: LM2576HVS-5.0V BUCK 5V 3A TO263-5; Don_Vi: Con; Ma_Hang: MH002362; Ghi_Chu: *; Kieu_Chan: *; Chung_Loai: Dán
VCOCXO_1 = VCOCXO 10MHz
Y1 = Thach Anh 2 chan Cam: Crystal For all Crystal 2pin.; Value: 4Mhz